# Altium schematic sheet BSE_APPS_Error_Detection.SchDoc
size 323 x 175 mm; Origin: Eagle
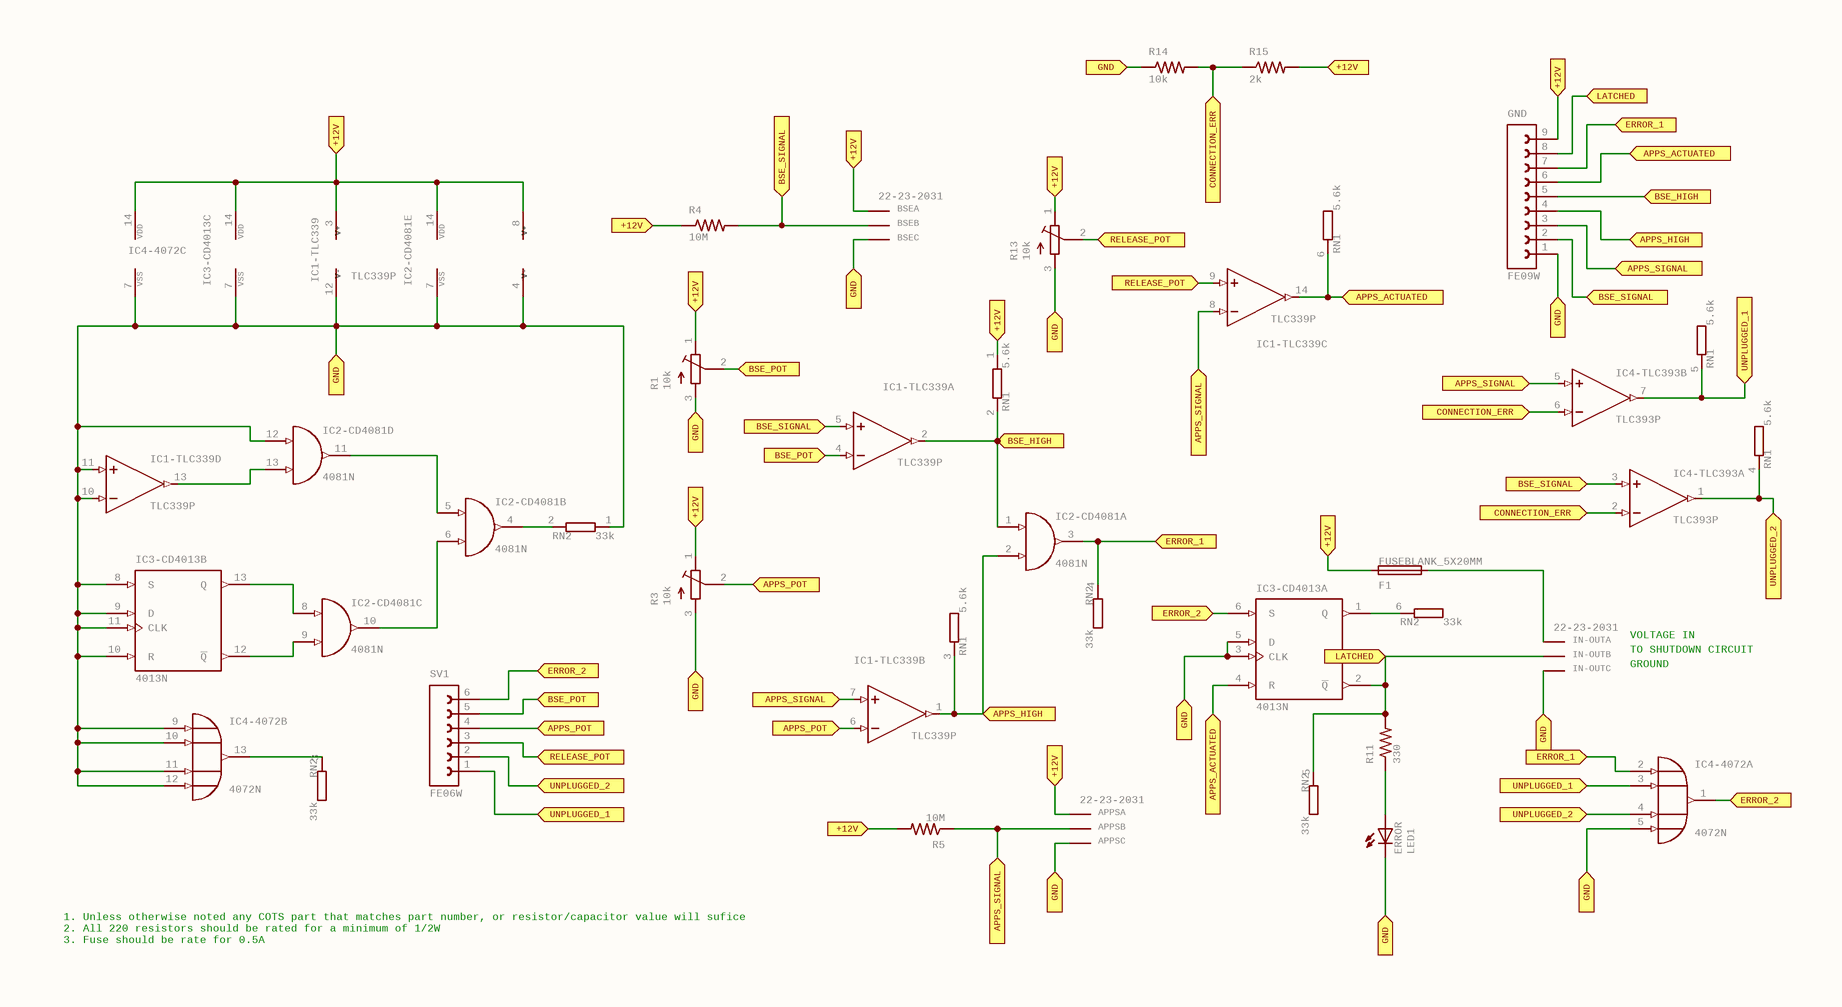
[diagram p0: BSE_APPS_Error_Detection.SchDoc]

## Parts
APPS  22-23-2031  [22-23-2031]  (parts A,B,C of 3)
BSE  22-23-2031  [22-23-2031]  (parts A,B,C of 3)
ERROR  LED1  [LED5MM]
F1  FUSEBLANK_5X20MM  [FUSE_HOLDER_5X20MM]
GND  FE09W  [FE09W]
IC1-TLC339  TLC339P  [DIL14]  (parts A,B,C,D,E of 5)
IC2-CD4081  4081N  [DIL14]  (parts A,B,C,D,E of 5)
IC3-CD4013  4013N  [DIL14]  (parts A,B,C of 3)
IC4-4072  4072N  [DIL14]  (parts A,B,C of 3)
IC4-TLC393  TLC393P  [DIL08]  (parts A,B,C of 3)
IN-OUT  22-23-2031  [22-23-2031]  (parts A,B,C of 3)
R1  10k  [RTRIM3006P]
R3  10k  [RTRIM3006P]
R4  10M  [0207/10]
R5  10M  [0207/10]
R11  330  [0207/10]
R13  10k  [RTRIM3006P]
R14  10k  [0207/10]
R15  2k  [0207/10]
RN1  5.6k  PART: RN1  [SIL6]  (parts A,B,C,D,E of 5)
RN2  33k  PART: RN2  [SIL6]  (parts A,B,C,D,E of 5)
SV1  FE06W  [FE06W]

## Ports
+12V (in), APPS_ACTUATED (in), APPS_HIGH (in), APPS_POT (in), APPS_SIGNAL (in), BSE_HIGH (in), BSE_POT (in), BSE_SIGNAL (in), CONNECTION_ERR (in), ERROR_1 (in), ERROR_2 (in), GND (in), LATCHED (in), RELEASE_POT (in), UNPLUGGED_1 (in), UNPLUGGED_2 (in)

## Nets
+12V: APPS.1(S) BSE.1(S) F1.1 GND.9 IC1-TLC339.3(V+) IC2-CD4081.14(VDD) IC3-CD4013.14(VDD) IC4-4072.14(VDD) IC4-TLC393.8(V+) R1.1(E) R3.1(E) R4.1 R5.2 R13.1(E) R15.2 RN1.1 ; port +12V
APPS_ACTUATED: GND.6 IC1-TLC339.14(OUT) IC3-CD4013.4(R) RN1.6 ; port APPS_ACTUATED
APPS_HIGH: GND.4 IC1-TLC339.1(OUT) IC2-CD4081.2(I1) RN1.3 ; port APPS_HIGH
APPS_POT: IC1-TLC339.6(-IN) R3.2(S) SV1.4 ; port APPS_POT
APPS_SIGNAL: APPS.2(S) GND.3 IC1-TLC339.7(+IN) IC1-TLC339.8(-IN) IC4-TLC393.5(+IN) R5.1 ; port APPS_SIGNAL
BSE_HIGH: GND.5 IC1-TLC339.2(OUT) IC2-CD4081.1(I0) RN1.2 ; port BSE_HIGH
BSE_POT: IC1-TLC339.4(-IN) R1.2(S) SV1.5 ; port BSE_POT
BSE_SIGNAL: BSE.2(S) GND.2 IC1-TLC339.5(+IN) IC4-TLC393.3(+IN) R4.2 ; port BSE_SIGNAL
CONNECTION_ERR: IC4-TLC393.2(-IN) IC4-TLC393.6(-IN) R14.2 R15.1 ; port CONNECTION_ERR
ERROR_1: GND.7 IC2-CD4081.3(O) IC4-4072.2(I0) RN2.4 ; port ERROR_1
ERROR_2: IC3-CD4013.6(S) IC4-4072.1(O) SV1.6 ; port ERROR_2
GND: APPS.3(S) BSE.3(S) ERROR.K(C) GND.1 IC1-TLC339.10(-IN) IC1-TLC339.11(+IN) IC1-TLC339.12(V-) IC2-CD4081.7(VSS) IC2-CD4081.12(I0) IC3-CD4013.3(CLK) IC3-CD4013.5(D) IC3-CD4013.7(VSS) IC3-CD4013.8(S) IC3-CD4013.9(D) IC3-CD4013.10(R) IC3-CD4013.11(CLK) IC4-4072.5(I3) IC4-4072.7(VSS) IC4-4072.9(I0) IC4-4072.10(I1) IC4-4072.11(I2) IC4-4072.12(I3) IC4-TLC393.4(V-) IN-OUT.3(S) R1.3(A) R3.3(A) R13.3(A) R14.1 RN2.1 ; port GND
LATCHED: GND.8 IC3-CD4013.2(~{Q}) IN-OUT.2(S) R11.2 RN2.5 ; port LATCHED
RELEASE_POT: IC1-TLC339.9(+IN) R13.2(S) SV1.3 ; port RELEASE_POT
UNPLUGGED_1: IC4-4072.3(I1) IC4-TLC393.7(OUT) RN1.5 SV1.1 ; port UNPLUGGED_1
UNPLUGGED_2: IC4-4072.4(I2) IC4-TLC393.1(OUT) RN1.4 SV1.2 ; port UNPLUGGED_2
NetERROR_A: ERROR.A R11.1
NetF1_2: F1.2 IN-OUT.1(S)
NetIC1-TLC339_13: IC1-TLC339.13(OUT) IC2-CD4081.13(I1)
NetIC2-CD4081_4: IC2-CD4081.4(O) RN2.2
NetIC2-CD4081_5: IC2-CD4081.5(I0) IC2-CD4081.11(O)
NetIC2-CD4081_6: IC2-CD4081.6(I1) IC2-CD4081.10(O)
NetIC2-CD4081_8: IC2-CD4081.8(I0) IC3-CD4013.13(Q)
NetIC2-CD4081_9: IC2-CD4081.9(I1) IC3-CD4013.12(~{Q})
NetIC3-CD4013_1: IC3-CD4013.1(Q) RN2.6
NetIC4-4072_13: IC4-4072.13(O) RN2.3

## Notes on the sheet
- (near IC1-TLC339) IC1-TLC339
- TO SHUTDOWN CIRCUIT
- VOLTAGE IN
- GROUND
- 1. Unless otherwise noted any COTS part that matches part number, or resistor/capacitor value will sufice
  2. All 220 resistors should be rated for a minimum of 1/2W
  3. Fuse should be rate for 0.5A

## Library data of the parts
APPS BSE IN-OUT = 22-23-2031: .100" (2.54mm) Center Header - 3 Pin; GateName_1: -1; SymbolName_1: MV; GateName_2: -2; SymbolName_2: M; GateName_3: -3; MF: MOLEX; SymbolName_3: M; LibraryName: con-molex; DeviceSetName: 22-23-2031; MPN: 22-23-2031; OC_FARNELL: 1462950; OC_NEWARK: 30C0862
ERROR = LED5MM: LED   OSRAM: - CHIPLED LG R971, LG N971, LY N971, LG Q971, LY Q971, LO R971, LY R971 LH N974, LH R974 LS Q976, LO Q976, LY Q976 LO Q996 - Hyper CHIPLED LW Q18S LB Q993, LB Q99A, LB R99A - SideLED LS A670, LO A670, LY A670, LG A670, LP A670 LB A673, LV A673, LT A673, LW A673 LH A674 LY A675 LS A676, LA A676, LO A676, LY A676, LW A676 LS A679, LY A679, LG A679 -  Hyper Micro SIDELEDÂ® LS Y876, LA Y876, LO Y876, LY Y876 LT Y87S - SmartLED LW L88C, LW L88S LB L89C, LB L89S, LG L890 LS L89K, LO L89K, LY L89K LS L896, LA L896, LO L896, LY L896 - TOPLED LS T670, LO T670, LY T670, LG T670, LP T670 LSG T670, LSP T670, LSY T670, LOP T670, LYG T670 LG T671, LOG T671, LSG T671 LB T673, LV T673, LT T673, LW T673 LH T674 LS T676, LA T676, LO T676, LY T676, LB T676, LH T676, LSB T676, LW T676 LB T67C, LV T67C, LT T67C, LS T67K, LO T67K, LY T67K, LW E67C LS E67B, LA E67B, LO E67B, LY E67B, LB E67C, LV E67C, LT E67C LW T67C LS T679, LY T679, LG T679 LS T770, LO T770, LY T770, LG T770, LP T770 LB T773, LV T773, LT T773, LW T773 LH T774 LS E675, LA E675, LY E675, LS T675 LS T776, LA T776, LO T776, LY T776, LB T776 LHGB T686 LT T68C, LB T68C - Hyper Mini TOPLEDÂ® LB M676 - Mini TOPLED SantanaÂ® LG M470 LS M47K, LO M47K, LY M47K    Source: http://www.osram.convergy.de   LUXEON: - LUMILEDÂ® LXK2-PW12-R00, LXK2-PW12-S00, LXK2-PW14-U00, LXK2-PW14-V00 LXK2-PM12-R00, LXK2-PM12-S00, LXK2-PM14-U00 LXK2-PE12-Q00, LXK2-PE12-R00, LXK2-PE12-S00, LXK2-PE14-T00, LXK2-PE14-U00 LXK2-PB12-K00, LXK2-PB12-L00, LXK2-PB12-M00, LXK2-PB14-N00, LXK2-PB14-P00, LXK2-PB14-Q00 LXK2-PR12-L00, LXK2-PR12-M00, LXK2-PR14-Q00, LXK2-PR14-R00 LXK2-PD12-Q00, LXK2-PD12-R00, LXK2-PD12-S00 LXK2-PH12-R00, LXK2-PH12-S00 LXK2-PL12-P00, LXK2-PL12-Q00, LXK2-PL12-R00    Source: www.luxeon.com   KINGBRIGHT:   KA-3528ASYC Source: www.kingbright.com; GateName_1: G$1; DeviceName: 5MM; SymbolName_1: LED; LibraryName: led; DeviceSetName: LED
F1 = FUSEBLANK_5X20MM: Fuse; GateName_1: G$1; SymbolName_1: FUSE; DeviceName: BLANK_5X20MM; LibraryName: fuse; DeviceSetName: FUSE; MF: MF; MPN: MPN; OC_FARNELL: unknown; OC_NEWARK: unknown
GND = FE09W: FEMALE HEADER; GateName_1: G$1; SymbolName_1: FE09-1; LibraryName: con-lsta; DeviceSetName: FE09W; MF: MF; MPN: MPN; OC_FARNELL: unknown; OC_NEWARK: unknown
IC1-TLC339 = TLC339P: COMPARATOR; GateName_1: A; SymbolName_1: OPAMP; GateName_2: B; GateName_3: C; GateName_4: D; GateName_5: P; SymbolName_5: PWR+-; DeviceSetName: TLC339; SymbolName_2: OPAMP; SymbolName_3: OPAMP; SymbolName_4: OPAMP; DeviceName: P; LibraryName: linear
IC2-CD4081 = 4081N: Quad 2-input AND; GateName_1: A; SymbolName_1: 4081; GateName_2: B; GateName_3: C; GateName_4: D; GateName_5: P; SymbolName_5: PWRN; DeviceName: N; SymbolName_2: 4081; SymbolName_3: 4081; SymbolName_4: 4081; LibraryName: 40xx; DeviceSetName: 4081
IC3-CD4013 = 4013N: Dual D FLIP FLOP, set/reset; GateName_1: A; SymbolName_1: 4013; GateName_2: B; GateName_3: P; SymbolName_3: PWRN; DeviceName: N; SymbolName_2: 4013; LibraryName: 40xx; DeviceSetName: 4013
IC4-4072 = 4072N: Dual 4-input OR; GateName_1: A; SymbolName_1: 4072; GateName_2: B; GateName_3: P; SymbolName_3: PWRN; DeviceName: N; SymbolName_2: 4072; LibraryName: 40xx; DeviceSetName: 4072
IC4-TLC393 = TLC393P: COMPARATOR; GateName_1: A; SymbolName_1: OPAMP; GateName_2: B; GateName_3: P; SymbolName_3: PWR+-; DeviceSetName: TLC393; SymbolName_2: OPAMP; DeviceName: P; LibraryName: linear
R1 R3 R13 = R-TRIMM3006P: Trimm resistor; GateName_1: G$1; SymbolName_1: R-TRIM; DeviceName: 3006P; LibraryName: rcl; DeviceSetName: R-TRIMM; SPICEMODEL: X; SPICEPREFIXL: POT
R4 R5 R11 R14 R15 = R-US_0207/10: RESISTOR, American symbol; GateName_1: G$1; SymbolName_1: R-US; DeviceSetName: R-US_; DeviceName: 0207/10; LibraryName: resistor
RN1 RN2 = GE05RP: SIL RESISTOR; GateName_1: A; SymbolName_1: R-PV; GateName_2: B; SymbolName_2: R-PV1; GateName_3: C; GateName_4: D; GateName_5: E; SymbolName_3: R-PV1; SymbolName_4: R-PV1; SymbolName_5: R-PV1; LibraryName: resistor-sil; DeviceSetName: GE05RP; MF: MF; MPN: MPN; OC_FARNELL: unknown; OC_NEWARK: unknown
SV1 = FE06W: FEMALE HEADER; GateName_1: G$1; SymbolName_1: FE06-1; LibraryName: con-lsta; DeviceSetName: FE06W; MF: MF; MPN: MPN; OC_FARNELL: unknown; OC_NEWARK: unknown